# Altium schematic sheet GPS_tracker_GPS_and_GSM.SchDoc
size 420 x 297 mm; SheetNumber: 3; SheetTotal: 3; ProjectTitle: Prj name
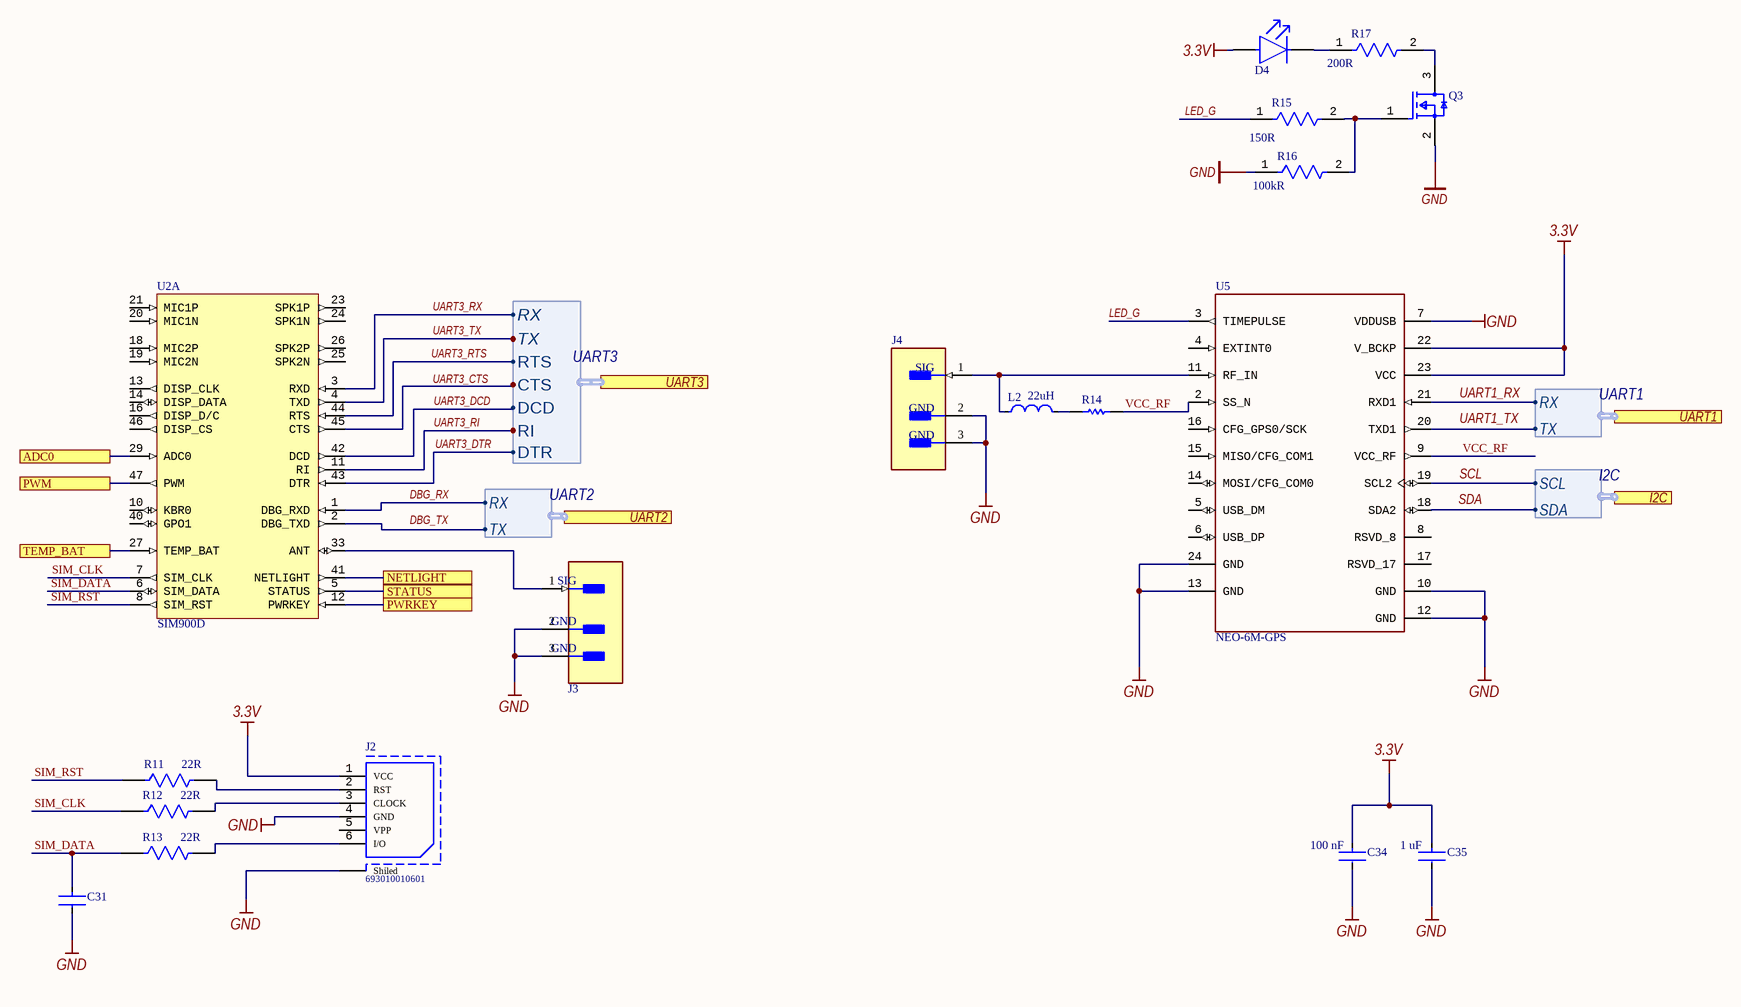
[diagram p0: GPS_tracker_GPS_and_GSM.SchDoc]

## Parts
C31  06035A220JAT2A  [FP-0603-L_1_6_0_15-W_0_81-IPC_C]  (value not drawn)
C34  Capacitance: 100 nF  [FP-CC0603-DA-MFG]  (hidden comment: CC0603KRX7R7BB104)
C35  Capacitance: 1 uF  [FP-CC0603-DA-MFG]  (hidden comment: CC0603KRX7R7BB105)
D4  SML-D12P8WT86C  [FP-SML-D12-MFG]  (value not drawn)
J2  693010010601  [693010010601]
J3  U.FL-R-SMT-1(10)  [FP-U_FL-R-SMT-1_10-MFG]  (value not drawn)
J4  U.FL-R-SMT-1(10)  [FP-U_FL-R-SMT-1_10-MFG]  (value not drawn)
L2  Inductance: 22uH  [FP-IHLP-2525CZ-FP_2_413x3-MFG]  (hidden comment: IHLP2525CZER220M11)
Q3  MMBF170LT1G  [FP-318-08-IPC_B]  (value not drawn)
R11  Resistance: 22R  [FP-CRCW0603-e3-IPC_B]  (hidden comment: CRCW060322R0FKEA)
R12  Resistance: 22R  [FP-CRCW0603-e3-IPC_B]  (hidden comment: CRCW060322R0FKEA)
R13  Resistance: 22R  [FP-CRCW0603-e3-IPC_B]  (hidden comment: CRCW060322R0FKEA)
R14  ERJ1GNF22R0C  [RESC0603X26X15ML03T05]  (value not drawn)
R15  Resistance: 150R  [FP-AC0603-MFG]  (hidden comment: AC0603FR-07150RL)
R16  Resistance: 100kR  [FP-RC0603-0_55-MFG]  (hidden comment: RC0603FR-07100KL)
R17  Resistance: 200R  [FP-ERJ3EK-IPC_C]  (hidden comment: ERJ-3EKF2000V)
U2  SIM900D  [SIMC-SIM900D_V]  (part A of 2)
U5  NEO-6M-GPS  [XCVR_NEO-6M-GPS]

## Ports
ADC0, I2C (harness I2C), NETLIGHT, PWM, PWRKEY, STATUS, TEMP_BAT, UART1 (harness UART1), UART2 (harness UART2), UART3 (harness UART3)

## Harnesses
UART1: RX, TX
UART2: RX, TX
UART3: RX, TX, RTS, CTS, DCD, RI, DTR
I2C: SCL, SDA

## Nets
3.3V: C34.1 C35.1 D4.2(A) J2.1(VCC) U5.22(V_BCKP) U5.23(VCC)
GND: C31.2 C34.2 C35.2 J2.4(GND) J2.Shiled J3.2(GND) J3.3(GND) J4.2(GND) J4.3(GND) Q3.2(S) R16.1 U5.7(VDDUSB) U5.10(GND) U5.12(GND) U5.13(GND) U5.24(GND)
ADC0: U2.29(ADC0) ; port ADC0
DBG_RX: U2.1(DBG_RXD) ; port UART2.RX
LED_G: R15.1 U5.3(TIMEPULSE)
NETLIGHT: U2.41(NETLIGHT) ; port NETLIGHT
PWM: U2.47(PWM) ; port PWM
PWRKEY: U2.12(PWRKEY) ; port PWRKEY
SCL: U5.19(SCL2) ; port I2C.SCL
SIM_CLK: R12.1 U2.7(SIM_CLK)
SIM_DATA: C31.1 R13.1 U2.6(SIM_DATA)
SIM_RST: R11.1 U2.8(SIM_RST)
STATUS: U2.5(STATUS) ; port STATUS
TEMP_BAT: U2.27(TEMP_BAT) ; port TEMP_BAT
UART1_RX: U5.21(RXD1) ; port UART1.RX
UART3_DCD: U2.42(DCD) ; port UART3.DCD
UART3_DTR: U2.43(DTR) ; port UART3.DTR
UART3_RI: U2.11(RI) ; port UART3.RI
UART3_RTS: U2.44(RTS) ; port UART3.RTS
UART3_RX: U2.3(RXD) ; port UART3.RX
UART3_TX: U2.4(TXD) ; port UART3.TX
VCC_RF: R14.2 U5.2(SS_N) U5.9(VCC_RF)
NetD4_1: D4.1(C) R17.1
NetJ2_2: J2.2(RST) R11.2
NetJ2_3: J2.3(CLOCK) R12.2
NetJ2_6: J2.6(I/O) R13.2
NetJ3_1: J3.1(SIG) U2.33(ANT)
NetJ4_1: J4.1(SIG) L2.1 U5.11(RF_IN)
NetL2_2: L2.2 R14.1
NetQ3_1: Q3.1(G) R15.2 R16.2
NetQ3_3: Q3.3(D) R17.2
NetU2_2: U2.2(DBG_TXD) ; port UART2.TX
NetU2_45: U2.45(CTS) ; port UART3.CTS
NetU5_18: U5.18(SDA2) ; port I2C.SDA
NetU5_20: U5.20(TXD1) ; port UART1.TX

Not connected (* = marked no-connect by the designer): J2 5(VPP); U2 10(KBR0) 13(DISP_CLK) 14(DISP_DATA) 16(DISP_D/C) 18(MIC2P) 19(MIC2N) 20(MIC1N) 21(MIC1P) 23(SPK1P) 24(SPK1N) 25(SPK2N) 26(SPK2P) 40(GPO1) 46(DISP_CS); U5 4(EXTINT0) 5(USB_DM) 6(USB_DP) 8(RSVD_8) 14(MOSI/CFG_COM0) 15(MISO/CFG_COM1) 16(CFG_GPS0/SCK) 17(RSVD_17)

## Notes on the sheet
- Labels drawn without touching a wire or pin: DBG_TX, SDA, UART1_TX, UART3_CTS
- Title:
- Author:
- Approved:
- Size:
- Date:
- Git Hash:
- A3
- Prj:
- Sheet
- of
- SW Version:
- Variant:
- Edited:
- CONFIDENTIAL
- File:

## Library data of the parts
C31 = CMP-2006-04207-3: General Purpose Ceramic Capacitor, 0603, 22pF, 5%, NP0, 30ppm/°C, 50V; Dielectric: C0G; Insulation Resistance: 100GR; Termination: SMD/SMT; Lead Free: Lead Free; Package Quantity: 1; Thickness: 0.035inch; Packaging: Tape and Reel; Radiation Hardening: No; Voltage Rating: 50V; Depth: 0.81mm; Case Code (Metric): 1608; Min Operating Temperature: -55°C; Number of Pins: 2; REACH SVHC: No SVHC; RoHS Compliant: Yes; Mount: Surface Mount; Case/Package: 0603; Width: 0.81mm; Case Code (Imperial): 0603; Max Operating Temperature: 125°C; Contact Plating: Tin; Temperature Coefficient: 30ppm/°C; Voltage Rating (DC): 50V; Height: 0.63mm; Dielectric Material: Ceramic; Capacitance: 22pF; Voltage: 50V; Length: 1.6mm; Tolerance: 5%
C34 = CMP-2000-05002-2: CAP CER 0.1UF 16V X7R 0603; Manufacturer: YAGEO; Tolerance: 0.1; Value: 100 nF; Temperature Coefficient: 15%; Material: Ceramic; Voltage Rating: 16 V; Package: CC0603-DA; ComponentLink2Description: Datasheet; Octopart: https://octopart.com/cc0603krx7r7bb104-yageo-192941; Temperature Range High: +125°C; Digikey Description: CAP CER 0.1UF 16V X7R 0603; Voltage: 16 V; Device Class L2: Capacitors; Height: 0.9mm; Temperature: -55°C to +125°C; Manufacturer Part Number: CC0603KRX7R7BB104; Device Class L1: Passive Components; Device Class L3: Ceramic Capacitors; ComponentLink2URL: http://www.yageo.com/documents/recent/UPY-GPHC_X7R_6.3V-to-50V_18.pdf; Footprint Url: http://www.yageo.com/exep/pages/download/literatures/UPY-C_GEN_24.pdf; RoHS: TRUE; Temperature Range Low: -55°C; Temperature Characteristic: X7R; Lead Free: Yes; Category: Cap; Mouser Description: Multilayer Ceramic Capacitor, CC Series, 0.1 - F, - 10%, X7R, 16 V, 0603 [1608 Metric]; Automotive: No
C35 = CMP-03422-000924-1: CAP CER 1UF 16V X7R 0603; Manufacturer: YAGEO; Tolerance: 0.1; Temperature Coefficient: 15%; Material: Ceramic; Package: CC0603-DA; RoHS: TRUE; Device Class L2: Capacitors; Temperature Characteristic: X7R; Temperature: -55°C to +125°C; Temperature Range Low: -55°C; Automotive: No; ComponentLink2Description: Datasheet; Value: 1 uF; Lead Free: Yes; ComponentLink2URL: http://www.yageo.com/documents/recent/UPY-GPHC_X7R_6.3V-to-50V_18.pdf; Device Class L1: Passive Components; Voltage: 16 V; Octopart: https://octopart.com/cc0603krx7r7bb105-yageo-42271928; Category: Cap; Digikey Description: CAP CER 1UF 16V X7R 0603; Footprint Url: http://www.yageo.com/exep/pages/download/literatures/UPY-C_GEN_24.pdf; Height: 0.9mm; Manufacturer Part Number: CC0603KRX7R7BB105; Voltage Rating: 16 V; Temperature Range High: +125°C; Mouser Description: Multilayer Ceramic Capacitor, CC Series, 1 - F, - 10%, X7R, 16 V, 0603 [1608 Metric]; Device Class L3: Ceramic Capacitors
D4 = CMP-08952-000001-1: LED GREEN 1608 SMD; Manufacturer: Rohm; Forward Current: 20mA; Luminous Intensity: 6.3mcd; Wavelength: 560nm; Automotive Grade: Grade 3; Reverse Voltage: 5V; Forward Voltage: 2.2V; Power Dissipation: 54mW; Led Orientation: Top View; Temperature Range Low: -40°C; Automotive: Yes; Height: 0.65mm; Manufacturer Part Number: SML-D12P8WT86C; Device Class L3: unset; Octopart: https://octopart.com/sml-d12p8wt86c-rohm-77740213; Lead Free: Yes; Digikey Description: LED GREEN 1608 SMD; Temperature Range High: +85°C; ComponentLink2URL: https://www.rohm.com/datasheet/SML-D12P8W(C)/sml-d12x8(c)-e; ComponentLink2Description: Datasheet; RoHS: TRUE; Device Class L2: LEDs; Package: SML-D12; Category: Diode; Temperature: -40°C to +85°C; Mouser Description: LED Uni-Color Green Automotive 2-Pin Chip 0603(1608Metric) T/R; Colour: Green; Device Class L1: Optoelectronics
J2 = CMP-1502-00154-1: WR-CRD Mini SIM Card Connector Header; Manufacturer: Wurth Elektronik; Working Voltage: 50VAC; Rated Current: 0.5A; Withstanding Voltage: 500VAC; Publisher: WurthElektronik; Part Number: 693010010601; Operating Temperature: -25to85degC; Packaging: TapeandReel; Datasheet URL: https://katalog.we-online.de/em/datasheet/693010010601.pdf; Package Reference: 693010010601; Mounting Technology: SMT; Manufacturer URL: http://www.we-online.de
J3 J4 = CMP-2000-05152-3: CONN U.FL RCPT STR 50 OHM SMD; Max Frequency: 6GHz; Connector Type: Coaxial; Body Plating: Silver; Body Material: Bronze; Impedance: 50R; Dielectric Material: Polymer; Insulation Resistance: 500MR; Gender: Male; Packaging: Cut Tape; Length: 3mm; Package Quantity: 2500; Termination: Solder; Lead Free: Lead Free; Series: U.FL; Min Operating Temperature: -40°C; Fastening Type: Snap; Contact Material: Brass; Orientation: Straight; Wire/Cable Type: Coaxial; Frequency: 6GHz; Contact Plating: Gold; Depth: 3.1mm; Weight: 0.001764oz; Max Operating Temperature: 90°C; Radiation Hardening: No; REACH SVHC: No SVHC; Mount: Surface Mount; Housing Color: Beige
L2 = CMP-2000-06442-2: Commercial Inductors, Low DCR Series 22uH 2.9A 135mΩ 20%; Self Resonant Frequency: 1MHz; Shielding: Shielded; Core Material: Ferrite; DC Resistance (DCR): 135mR; Test Frequency: 100kHz; Saturation Current: 2.5A; Case/Package: 2525; Inductance Tolerance: 20%; Max DC Current: 2.9A; Termination: SMD/SMT; Case Code (Imperial): 2525; Mount: Surface Mount; Military Standard: Not; Min Operating Temperature: -55°C; RMS Current (Irms): 2.9A; Package Quantity: 2000; Max Operating Temperature: 125°C; Length: 7.24mm; Depth: 6.72mm; Packaging: Tape and Reel; Height: 3mm; Width: 0.255inch; Lead Free: Lead Free; Tolerance: 20%; Contact Plating: Tin; Current Rating: 2.9A; Number of Pins: 2; Case Code (Metric): 6363; Radiation Hardening: No; Height - Seated (Max): 0.118inch
Q3 = CMP-1058-00793-2: MOSFET N-CH 60V 500MA SOT-23; Polarization: N; Rds On Max: 5R; Power Dissipation: 225mW; Number of Elements: 1; Element Configuration: Single; Input Capacitance: 60pF; Threshold Voltage: 3V; Polarity: N-CHANNEL; Gate to Source Voltage (Vgs): 20V; Turn-Off Delay Time: 10ns; Drain to Source Breakdown Voltage: 60V; On-State Resistance: 5R; Width: 1.3mm; Voltage Rating (DC): 60V; Package Quantity: 3000; Max Operating Temperature: 150°C; Drain to Source Resistance: 5R; Drain-source On Resistance-Max: 5R; Packaging: Tape and Reel; REACH SVHC: No SVHC; Case/Package: SOT-23-3; Number of Pins: 3; RoHS Compliant: Yes; Radiation Hardening: No; Min Operating Temperature: -55°C; Continuous Drain Current (ID): 500mA; Lead Free: Lead Free; Height: 0.94mm; Current Rating: 500mA; Turn-On Delay Time: 10ns; Series: -; Max Power Dissipation: 225mW; Length: 2.9mm; Nominal Vgs: 3V
R11-R13 = CMP-2000-03097-2: RES Thick Film, 22Ω, 1%, 0.1W, 100ppm/°C, 0603; Voltage Rating: 75V; Power Rating: 100mW; Lead Free: Lead Free; Height: 0.45mm; Package Quantity: 5000; Weight: 7.1E-05oz; Width: 0.85mm; Length: 1.55mm; Mount: Surface Mount; Packaging: Tape and Reel; Termination: SMD/SMT; Temperature Coefficient: 100ppm/°C; Case/Package: 0603; Case Code (Metric): 1608; Radiation Hardening: No; Max Operating Temperature: 155°C; Military Standard: Not; Min Operating Temperature: -55°C; Case Code (Imperial): 0603; Contact Plating: Tin; Voltage Rating (DC): 75V; Tolerance: 1%; Depth: 0.85mm; Composition: Thick Film
R14 = CMP-2004-03488-1: Manufacturer: Panasonic; Part Number: ERJ1GNF22R0C
R15 = CMP-2000-04821-3: RES 150Ω 1.00% 0.1W 0603; Voltage Rating: 50V; Power Rating: 100mW; Temperature Coefficient: 100ppm/°C; Tolerance: 1%; Resistor Type: Thick Film; Features: Moisture Resistant; Ratings: AEC-Q200; Width: 0.8mm; Packaging: Tape and Reel; Case/Package: 0603; Series: AC; RoHS Compliant: Yes; Max Power Dissipation: 100mW; Case Code (Imperial): 0603; Min Operating Temperature: -55°C; Height: 0.45mm; Termination: SMD/SMT; Number of Terminations: 2; Case Code (Metric): 1608; Max Operating Temperature: 155°C; Length: 1.6mm
R16 = CMP-2100-03662-2: RES SMD 100K OHM 1% 1/10W 0603; Voltage Rating (DC): 50V; Max Power Dissipation: 100mW; Temperature Coefficient: 100ppm/°C; Working Voltage: 75V; Length: 1.6mm; Lead Free: Lead Free; Number of Terminations: 2; Packaging: Tape and Reel; Voltage Rating: 50V; Termination: SMD/SMT; Width: 0.8mm; Resistor Type: Thick Film; Resistance Tolerance: 1%; Features: Moisture Resistant; Height: 0.45mm; Construction: Rectangular; Case/Package: 0603; Military Standard: Not; Case Code (Imperial): 0603; Series: RC; Technology: THICK FILM; Depth: 0.8mm; RoHS Compliant: Yes; REACH SVHC: No SVHC; Min Operating Temperature: -55°C; Case Code (Metric): 1608; Max Operating Temperature: 155°C; Power Rating: 100mW; Number of Pins: 2; Tolerance: 1%
R17 = CMP-2000-00316-2: RES SMD 200 OHM 1% 1/10W 0603; Power Rating: 100mW; Temperature Coefficient: 100ppm/°C; Voltage Rating (DC): 50V; Voltage Rating: 75V; Tolerance: 1%; Lead Free: Lead Free; Packaging: Tape and Reel; Case/Package: 0603; Contact Plating: Tin; Case Code (Imperial): 0603; Min Operating Temperature: -55°C; Max Operating Temperature: 155°C; Max Power Dissipation: 100mW; Features: Automotive AEC-Q200; Technology: THICK FILM; Package Quantity: 1; Resistor Type: Thick Film; REACH SVHC: No SVHC; Termination: SMD/SMT; Length: 1.6mm; Resistance Tolerance: 1%; Series: ERJ; Military Standard: Not; Radiation Hardening: No; Working Voltage: 75V; Case Code (Metric): 1608; RoHS Compliant: Yes; Mount: Surface Mount; Construction: Rectangular; Width: 0.031inch; Number of Terminations: 2; Depth: 0.8mm; Height: 0.022inch
U2 = CMP-2000-07069-1: Quad-Band GSM/GPRS Module, 850/900/1800/1900 MHz, 3.2 to 4.8 V, -40 to 85 degC, 48-Pin SMD, RoHS, Tape and Reel; Manufacturer: SIM Com; Datasheet Version: Rev. 2.02, 05/2012; Datasheet URL: http://mt-system.ru/sites/default/files/documents/sim900d_hardware_design_v2.02_0.pdf; Mounting Technology: SurfaceMount; Package Description: 48-Pin Surface Mount Device, Body 33 x 33 mm, Pitch 1.5 mm; Package Reference: SIM900D; Manufacturer URL: http://simcomm2m.com/
U5 = NEO-6M-GPS: GPS Development Tools SparkFun GNSS-RTK Dead Reckoning Breakout - ZED-F9K (Qwiic); MF: u-blox; SnapEDA_Link: https://www.snapeda.com/parts/NEO-6M-GPS/u-blox/view-part/?ref=snap; MP: NEO-6M-GPS; Availability: Not in stock; Price: None; Check_prices: https://www.snapeda.com/parts/NEO-6M-GPS/u-blox/view-part/?ref=eda; Value: *; Package: None